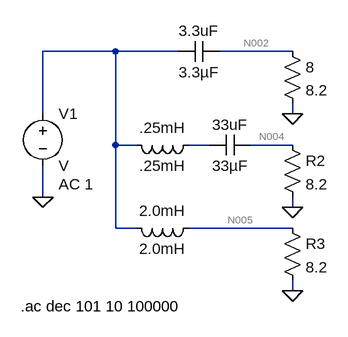
[diagram p0: schematic LAST_LAB.asc]
LAST_LAB.asc, the LTspice schematic file:
Version 4
SHEET 1 880 680
WIRE 32 16 -80 16
WIRE 128 16 32 16
WIRE 304 16 192 16
WIRE -80 112 -80 16
WIRE 304 112 304 96
WIRE 32 160 32 16
WIRE 64 160 32 160
WIRE 176 160 144 160
WIRE 304 160 240 160
WIRE -80 240 -80 192
WIRE 304 256 304 240
WIRE 32 288 32 160
WIRE 64 288 32 288
WIRE 304 288 144 288
WIRE 304 384 304 368
FLAG -80 240 0
FLAG 304 112 0
FLAG 304 256 0
FLAG 304 384 0
SYMBOL voltage -80 96 R0
WINDOW 123 24 124 Left 2
WINDOW 39 0 0 Left 2
SYMATTR InstName V1
SYMATTR Value2 AC 1
SYMATTR SpiceLine ""
SYMBOL res 288 0 R0
SYMATTR InstName 8
SYMATTR Value 8.2
SYMATTR SpiceLine ""
SYMBOL res 288 144 R0
SYMATTR InstName R2
SYMATTR Value 8.2
SYMATTR SpiceLine ""
SYMBOL res 288 272 R0
SYMATTR InstName R3
SYMATTR Value 8.2
SYMATTR SpiceLine ""
SYMBOL ind 160 144 R90
WINDOW 0 5 56 VBottom 2
WINDOW 3 32 56 VTop 2
SYMATTR InstName .25mH
SYMATTR Value .25mH
SYMATTR SpiceLine ""
SYMBOL ind 160 272 R90
WINDOW 0 5 56 VBottom 2
WINDOW 3 32 56 VTop 2
SYMATTR InstName 2.0mH
SYMATTR Value 2.0mH
SYMATTR SpiceLine ""
SYMBOL cap 192 0 R90
WINDOW 0 0 32 VBottom 2
WINDOW 3 32 32 VTop 2
SYMATTR InstName 3.3uF
SYMATTR Value 3.3µF
SYMBOL cap 240 144 R90
WINDOW 0 0 32 VBottom 2
WINDOW 3 32 32 VTop 2
SYMATTR InstName 33uF
SYMATTR Value 33µF
SYMATTR SpiceLine ""
TEXT -114 408 Left 2 !.ac dec 101 10 100000

The netlist it stands for:
* LAST_LAB.asc
V1 N001 0 V AC 1
R§8 N002 0 8.2
R2 N004 0 8.2
R3 N005 0 8.2
L§.25mH N003 N001 .25mH
L§2.0mH N005 N001 2.0mH
C§3.3uF N002 N001 3.3µF
C§33uF N004 N003 33µF
.ac dec 101 10 100000
.backanno
.end

* Results of the author's LTspice run, read from the files saved beside the schematic
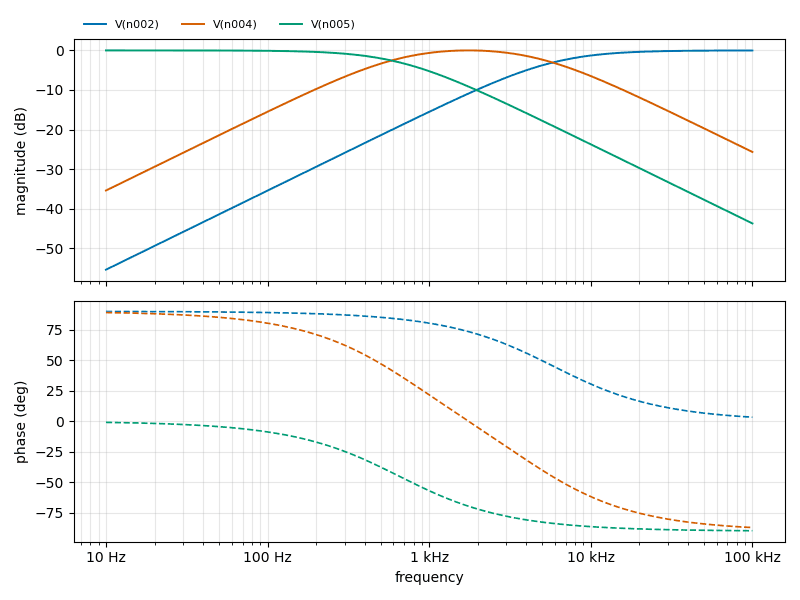
[diagram p1: AC Analysis of LAST_LAB.asc, plotted from the saved traces]
* AC Analysis, 1 run:
*   V(n002): -55.39 dB at 10 Hz, -0.01 dB at 100 kHz, peak -0.01 dB at 100 kHz, 3 dB below the peak at 5.862 kHz
*   V(n004): -35.39 dB at 10 Hz, -25.66 dB at 100 kHz, peak -0.00 dB at 1.768 kHz, 3 dB below the peak at 533.6 Hz and 5.754 kHz
*   V(n005): -0.00 dB at 10 Hz, -43.71 dB at 100 kHz, peak -0.00 dB at 10 Hz, 3 dB below the peak at 652.7 Hz